# Altium schematic sheet 1_P1.schdoc
size 604 x 431 mm; Symbol: Sheet-Symbol_A4; Device: Sheet-Symbol_A4; Company: EasyEDA.com; Drawed: EasyEDA Pro; Reviewed: EasyEDA Pro; Version: V0.1; Page Size: A4; @Project Name: URC merc keyboard; @Page Count: 1; @Update Date: 2023-11-06; @Create Date: 2023-06-26; @Schematic Name: Schematic2; Part Number: JLCPCB-002; @Page No: 1; @Page Name: P1
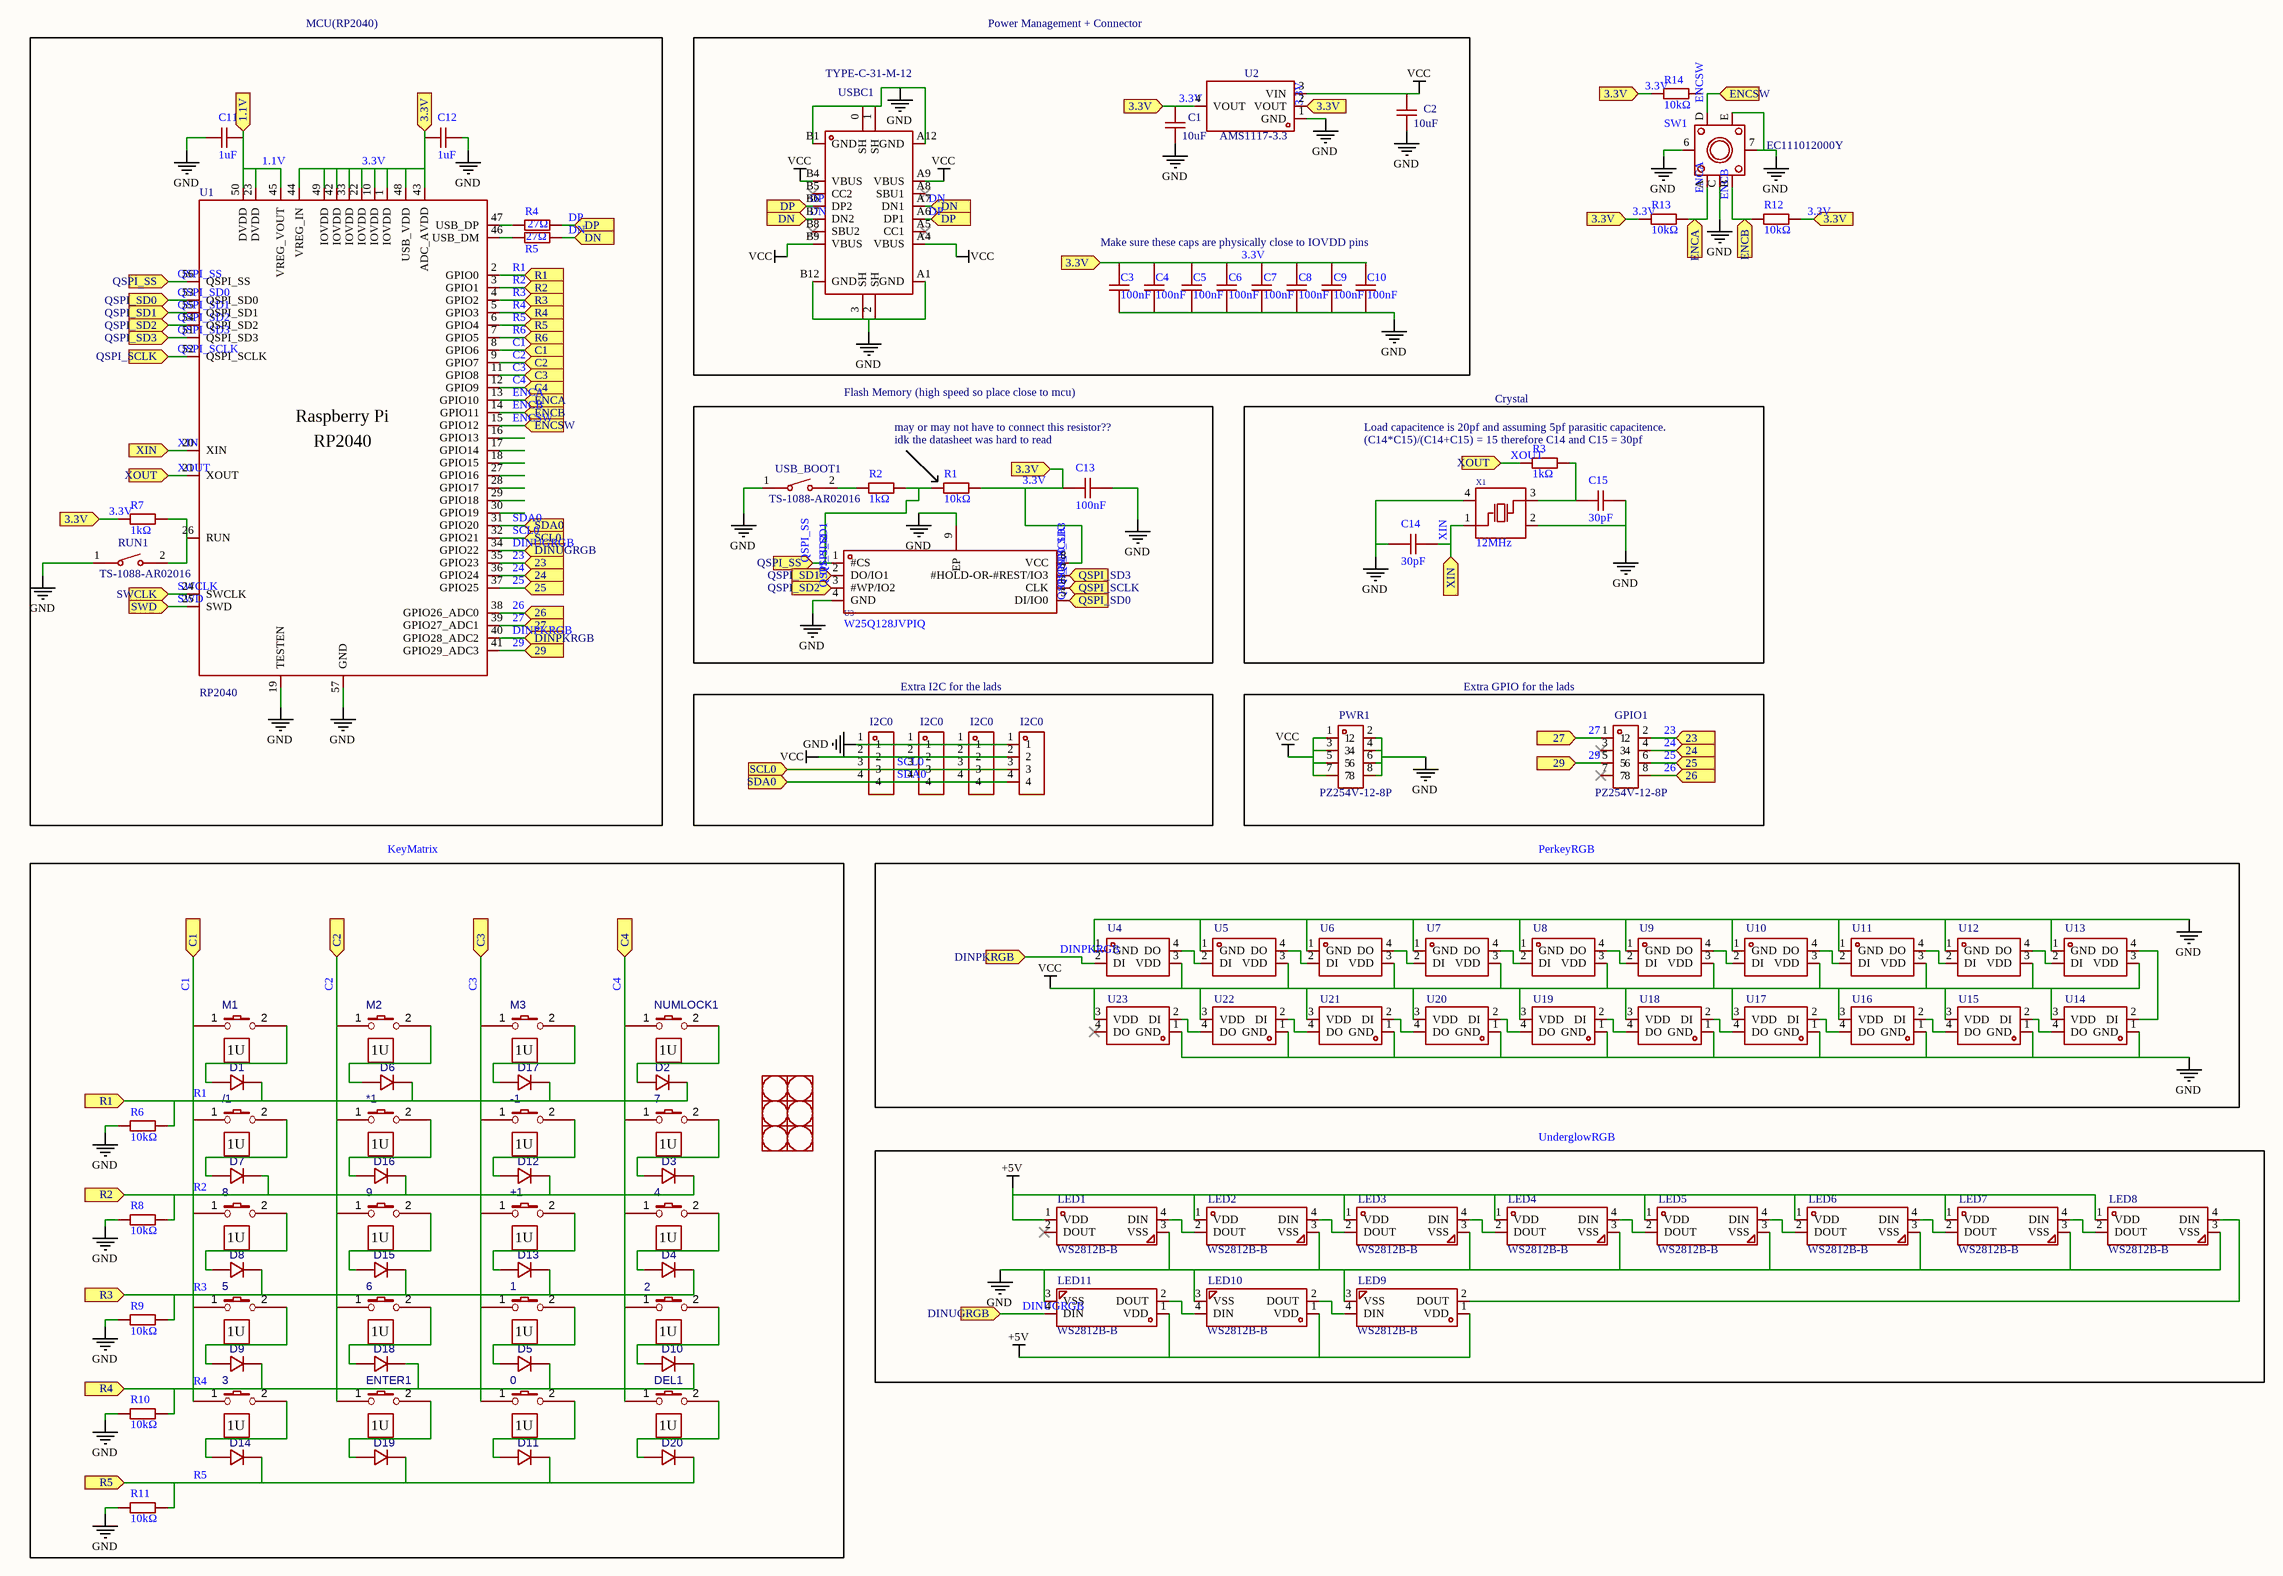
[diagram p0: 1_P1.schdoc]

## Parts
(Parts that share a designator on the sheet are numbered #1, #2 ... from top to bottom, then left to right.)
0  CHERRY-MX-SW-1U  [CHERRY-MX-PCB-1U]  (value not drawn)
1  CHERRY-MX-SW-1U  [CHERRY-MX-PCB-1U]  (value not drawn)
2  CHERRY-MX-SW-1U  [CHERRY-MX-PCB-1U]  (value not drawn)
3  CHERRY-MX-SW-1U  [CHERRY-MX-PCB-1U]  (value not drawn)
4  CHERRY-MX-SW-1U  [CHERRY-MX-PCB-1U]  (value not drawn)
5  CHERRY-MX-SW-1U  [CHERRY-MX-PCB-1U]  (value not drawn)
6  CHERRY-MX-SW-1U  [CHERRY-MX-PCB-1U]  (value not drawn)
7  CHERRY-MX-SW-1U  [CHERRY-MX-PCB-1U]  (value not drawn)
8  CHERRY-MX-SW-1U  [CHERRY-MX-PCB-1U]  (value not drawn)
9  CHERRY-MX-SW-1U  [CHERRY-MX-PCB-1U]  (value not drawn)
*1  CHERRY-MX-SW-1U  [CHERRY-MX-PCB-1U]  (value not drawn)
+1  CHERRY-MX-SW-1U  [CHERRY-MX-PCB-1U]  (value not drawn)
-1  CHERRY-MX-SW-1U  [CHERRY-MX-PCB-1U]  (value not drawn)
/1  CHERRY-MX-SW-1U  [CHERRY-MX-PCB-1U]  (value not drawn)
C1  10uF  [C0402]
C2  10uF  [C0402]
C3  100nF  [C0201]
C4  100nF  [C0201]
C5  100nF  [C0201]
C6  100nF  [C0201]
C7  100nF  [C0201]
C8  100nF  [C0201]
C9  100nF  [C0201]
C10  100nF  [C0201]
C11  1uF  [C0201]
C12  1uF  [C0201]
C13  100nF  [C0201]
C14  30pF  [C0201]
C15  30pF  [C0201]
D1  1N4148_C14538  [DO-35_BD2.0-L4.2-P8.20-D0.5-RD]  (value not drawn)
D2  1N4148_C14538  [DO-35_BD2.0-L4.2-P8.20-D0.5-RD]  (value not drawn)
D3  1N4148_C14538  [DO-35_BD2.0-L4.2-P8.20-D0.5-RD]  (value not drawn)
D4  1N4148_C14538  [DO-35_BD2.0-L4.2-P8.20-D0.5-RD]  (value not drawn)
D5  1N4148_C14538  [DO-35_BD2.0-L4.2-P8.20-D0.5-RD]  (value not drawn)
D6  1N4148_C14538  [DO-35_BD2.0-L4.2-P8.20-D0.5-RD]  (value not drawn)
D7  1N4148_C14538  [DO-35_BD2.0-L4.2-P8.20-D0.5-RD]  (value not drawn)
D8  1N4148_C14538  [DO-35_BD2.0-L4.2-P8.20-D0.5-RD]  (value not drawn)
D9  1N4148_C14538  [DO-35_BD2.0-L4.2-P8.20-D0.5-RD]  (value not drawn)
D10  1N4148_C14538  [DO-35_BD2.0-L4.2-P8.20-D0.5-RD]  (value not drawn)
D11  1N4148_C14538  [DO-35_BD2.0-L4.2-P8.20-D0.5-RD]  (value not drawn)
D12  1N4148_C14538  [DO-35_BD2.0-L4.2-P8.20-D0.5-RD]  (value not drawn)
D13  1N4148_C14538  [DO-35_BD2.0-L4.2-P8.20-D0.5-RD]  (value not drawn)
D14  1N4148_C14538  [DO-35_BD2.0-L4.2-P8.20-D0.5-RD]  (value not drawn)
D15  1N4148_C14538  [DO-35_BD2.0-L4.2-P8.20-D0.5-RD]  (value not drawn)
D16  1N4148_C14538  [DO-35_BD2.0-L4.2-P8.20-D0.5-RD]  (value not drawn)
D17  1N4148_C14538  [DO-35_BD2.0-L4.2-P8.20-D0.5-RD]  (value not drawn)
D18  1N4148_C14538  [DO-35_BD2.0-L4.2-P8.20-D0.5-RD]  (value not drawn)
D19  1N4148_C14538  [DO-35_BD2.0-L4.2-P8.20-D0.5-RD]  (value not drawn)
D20  1N4148_C14538  [DO-35_BD2.0-L4.2-P8.20-D0.5-RD]  (value not drawn)
DEL1  CHERRY-MX-SW-1U  [CHERRY-MX-PCB-1U]  (value not drawn)
ENTER1  CHERRY-MX-SW-1U  [CHERRY-MX-PCB-1U]  (value not drawn)
GPIO1  PZ254V-12-8P  [HDR-TH_8P-P2.54-V-M-R2-C4-S2.54]
I2C0#1  PZ200V-11-04P  [HDR-TH_4P-P2.00-V-M]  (value not drawn)
I2C0#2  PZ200V-11-04P  [HDR-TH_4P-P2.00-V-M]  (value not drawn)
I2C0#3  PZ200V-11-04P  [HDR-TH_4P-P2.00-V-M]  (value not drawn)
I2C0#4  PZ200V-11-04P  [HDR-TH_4P-P2.00-V-M]  (value not drawn)
LED1  WS2812B-B  [LED-SMD_4P-L5.0-W5.0-BL_TC5050RGB]
LED2  WS2812B-B  [LED-SMD_4P-L5.0-W5.0-BL_TC5050RGB]
LED3  WS2812B-B  [LED-SMD_4P-L5.0-W5.0-BL_TC5050RGB]
LED4  WS2812B-B  [LED-SMD_4P-L5.0-W5.0-BL_TC5050RGB]
LED5  WS2812B-B  [LED-SMD_4P-L5.0-W5.0-BL_TC5050RGB]
LED6  WS2812B-B  [LED-SMD_4P-L5.0-W5.0-BL_TC5050RGB]
LED7  WS2812B-B  [LED-SMD_4P-L5.0-W5.0-BL_TC5050RGB]
LED8  WS2812B-B  [LED-SMD_4P-L5.0-W5.0-BL_TC5050RGB]
LED9  WS2812B-B  [LED-SMD_4P-L5.0-W5.0-BL_TC5050RGB]
LED10  WS2812B-B  [LED-SMD_4P-L5.0-W5.0-BL_TC5050RGB]
LED11  WS2812B-B  [LED-SMD_4P-L5.0-W5.0-BL_TC5050RGB]
M1  CHERRY-MX-SW-1U  [CHERRY-MX-PCB-1U]  (value not drawn)
M2  CHERRY-MX-SW-1U  [CHERRY-MX-PCB-1U]  (value not drawn)
M3  CHERRY-MX-SW-1U  [CHERRY-MX-PCB-1U]  (value not drawn)
NUMLOCK1  CHERRY-MX-SW-1U  [CHERRY-MX-PCB-1U]  (value not drawn)
PWR1  PZ254V-12-8P  [HDR-TH_8P-P2.54-V-M-R2-C4-S2.54]
R1  10kΩ  [R0201]
R2  1kΩ  [R0201]
R3  1kΩ  [R0201]
R4  27Ω  [R0201]
R5  27Ω  [R0201]
R6  10kΩ  [R0201]
R7  1kΩ  [R0201]
R8  10kΩ  [R0201]
R9  10kΩ  [R0201]
R10  10kΩ  [R0201]
R11  10kΩ  [R0201]
R12  10kΩ  [R0201]
R13  10kΩ  [R0201]
R14  10kΩ  [R0201]
RUN1  TS-1088-AR02016  [SW-SMD_L3.9-W3.0-P4.45]
STB_1  Cherry MX Stabilizer  [CHERRY MX SWITCH STAB]  (value not drawn)
STB_2  Cherry MX Stabilizer  [CHERRY MX SWITCH STAB]  (value not drawn)
STB_3  Cherry MX Stabilizer  [CHERRY MX SWITCH STAB]  (value not drawn)
STB_4  Cherry MX Stabilizer  [CHERRY MX SWITCH STAB]  (value not drawn)
STB_5  Cherry MX Stabilizer  [CHERRY MX SWITCH STAB]  (value not drawn)
STB_6  Cherry MX Stabilizer  [CHERRY MX SWITCH STAB]  (value not drawn)
SW1  EC111012000Y  [SW-TH_EC111012000Y]
U1  RP2040  [LQFN-56_L7.0-W7.0-P0.4-EP]
U2  AMS1117-3.3  [SOT-223-3_L6.5-W3.4-P2.30-LS7.0-BR]
U3  W25Q128JVPIQ  [WSON-8_L6.0-W5.0-P1.27-BL-EP]
U4  XL-2121RGBC-WS2812B  [LED-SMD_4P-L2.1-W2.1-BL]  (value not drawn)
U5  XL-2121RGBC-WS2812B  [LED-SMD_4P-L2.1-W2.1-BL]  (value not drawn)
U6  XL-2121RGBC-WS2812B  [LED-SMD_4P-L2.1-W2.1-BL]  (value not drawn)
U7  XL-2121RGBC-WS2812B  [LED-SMD_4P-L2.1-W2.1-BL]  (value not drawn)
U8  XL-2121RGBC-WS2812B  [LED-SMD_4P-L2.1-W2.1-BL]  (value not drawn)
U9  XL-2121RGBC-WS2812B  [LED-SMD_4P-L2.1-W2.1-BL]  (value not drawn)
U10  XL-2121RGBC-WS2812B  [LED-SMD_4P-L2.1-W2.1-BL]  (value not drawn)
U11  XL-2121RGBC-WS2812B  [LED-SMD_4P-L2.1-W2.1-BL]  (value not drawn)
U12  XL-2121RGBC-WS2812B  [LED-SMD_4P-L2.1-W2.1-BL]  (value not drawn)
U13  XL-2121RGBC-WS2812B  [LED-SMD_4P-L2.1-W2.1-BL]  (value not drawn)
U14  XL-2121RGBC-WS2812B  [LED-SMD_4P-L2.1-W2.1-BL]  (value not drawn)
U15  XL-2121RGBC-WS2812B  [LED-SMD_4P-L2.1-W2.1-BL]  (value not drawn)
U16  XL-2121RGBC-WS2812B  [LED-SMD_4P-L2.1-W2.1-BL]  (value not drawn)
U17  XL-2121RGBC-WS2812B  [LED-SMD_4P-L2.1-W2.1-BL]  (value not drawn)
U18  XL-2121RGBC-WS2812B  [LED-SMD_4P-L2.1-W2.1-BL]  (value not drawn)
U19  XL-2121RGBC-WS2812B  [LED-SMD_4P-L2.1-W2.1-BL]  (value not drawn)
U20  XL-2121RGBC-WS2812B  [LED-SMD_4P-L2.1-W2.1-BL]  (value not drawn)
U21  XL-2121RGBC-WS2812B  [LED-SMD_4P-L2.1-W2.1-BL]  (value not drawn)
U22  XL-2121RGBC-WS2812B  [LED-SMD_4P-L2.1-W2.1-BL]  (value not drawn)
U23  XL-2121RGBC-WS2812B  [LED-SMD_4P-L2.1-W2.1-BL]  (value not drawn)
USB_BOOT1  TS-1088-AR02016  [SW-SMD_L3.9-W3.0-P4.45]
USBC1  TYPE-C-31-M-12  [USB-C_SMD-TYPE-C-31-M-12]
X1  12MHz  [CRYSTAL-SMD_4P-L3.2-W2.5-BL]

## Blocks framed on the sheet
MCU(RP2040): C11 C12 R4 R5 R7 RUN1 U1
Flash Memory (high speed so place close to mcu): C13 R1 R2 U3 USB_BOOT1
Crystal: C14 C15 R3 X1
Extra I2C for the lads: I2C0#1-I2C0#4
Extra GPIO for the lads: GPIO1 PWR1
KeyMatrix: 0-9 *1 +1 -1 /1 D1-D20 DEL1 ENTER1 M1-M3 NUMLOCK1 R6 R8-R11 STB_1-STB_6
PerkeyRGB: U4-U23
UnderglowRGB: LED1-LED11

## Ports
1.1V (in), 3.3V (in), 23 (in), 24 (in), 25 (in), 26 (in), 27 (in), 29 (in), C1 (in), C2 (in), C3 (in), C4 (in), DINPKRGB (in), DINUGRGB (in), DN (in), DP (in), ENCA (in), ENCB (in), ENCSW (in), QSPI_SCLK (in), QSPI_SD0 (in), QSPI_SD1 (in), QSPI_SD2 (in), QSPI_SD3 (in), QSPI_SS (in), R1 (in), R2 (in), R3 (in), R4 (in), R5 (in), R6 (in), SCL0 (in), SDA0 (in), SWCLK (in), SWD (in), XIN (in), XOUT (in)

## Nets
+5V: LED1.1(VDD) LED2.1(VDD) LED3.1(VDD) LED4.1(VDD) LED5.1(VDD) LED6.1(VDD) LED7.1(VDD) LED8.1(VDD) LED9.1(VDD) LED10.1(VDD) LED11.1(VDD)
GND: C1.1 C2.1 C3.1 C4.1 C5.1 C6.1 C7.1 C8.1 C9.1 C10.1 C11.1 C12.2 C13.1 C14.2 C15.1 I2C0#1.1 I2C0#2.1 I2C0#3.1 I2C0#4.1 LED1.3(VSS) LED2.3(VSS) LED3.3(VSS) LED4.3(VSS) LED5.3(VSS) LED6.3(VSS) LED7.3(VSS) LED8.3(VSS) LED9.3(VSS) LED10.3(VSS) LED11.3(VSS) PWR1.2 PWR1.4 PWR1.6 PWR1.8 R6.1 R8.1 R9.1 R10.1 R11.1 RUN1.1 SW1.6 SW1.7 SW1.C SW1.E U1.19(TESTEN) U1.57(GND) U2.1(GND) U3.4(GND) U3.9(EP) U4.1(GND) U5.1(GND) U6.1(GND) U7.1(GND) U8.1(GND) U9.1(GND) U10.1(GND) U11.1(GND) U12.1(GND) U13.1(GND) U14.1(GND) U15.1(GND) U16.1(GND) U17.1(GND) U18.1(GND) U19.1(GND) U20.1(GND) U21.1(GND) U22.1(GND) U23.1(GND) USB_BOOT1.1 USBC1.0(SH) USBC1.1(SH) USBC1.2(SH) USBC1.3(SH) USBC1.A1(GND) USBC1.A12(GND) USBC1.B1(GND) USBC1.B12(GND) X1.2(GND) X1.4(GND)
VCC: C2.2 I2C0#1.2 I2C0#2.2 I2C0#3.2 I2C0#4.2 PWR1.1 PWR1.3 PWR1.5 PWR1.7 U2.3(VIN) U4.3(VDD) U5.3(VDD) U6.3(VDD) U7.3(VDD) U8.3(VDD) U9.3(VDD) U10.3(VDD) U11.3(VDD) U12.3(VDD) U13.3(VDD) U14.3(VDD) U15.3(VDD) U16.3(VDD) U17.3(VDD) U18.3(VDD) U19.3(VDD) U20.3(VDD) U21.3(VDD) U22.3(VDD) U23.3(VDD) USBC1.A4(VBUS) USBC1.A9(VBUS) USBC1.B4(VBUS) USBC1.B9(VBUS)
1.1V: C11.2 U1.23(DVDD) U1.45(VREG_VOUT) U1.50(DVDD) ; port 1.1V
3.3V: C1.2 C3.2 C4.2 C5.2 C6.2 C7.2 C8.2 C9.2 C10.2 C12.1 C13.2 R1.2 R7.1 R12.2 R13.1 R14.1 U1.1(IOVDD) U1.10(IOVDD) U1.22(IOVDD) U1.33(IOVDD) U1.42(IOVDD) U1.43(ADC_AVDD) U1.44(VREG_IN) U1.48(USB_VDD) U1.49(IOVDD) U2.2(VOUT) U2.4(VOUT) U3.8(VCC) ; port 3.3V
23: GPIO1.2 U1.35(GPIO23) ; port 23
24: GPIO1.4 U1.36(GPIO24) ; port 24
25: GPIO1.6 U1.37(GPIO25) ; port 25
26: GPIO1.8 U1.38(GPIO26_ADC0) ; port 26
27: GPIO1.1 U1.39(GPIO27_ADC1) ; port 27
29: GPIO1.5 U1.41(GPIO29_ADC3) ; port 29
C1: 3.1(col) 5.1(col) 8.1(col) /1.1(col) D1.1 D2.1 D3.1 D4.1 D5.1 D6.1 D7.1 D8.1 D9.1 D10.1 D12.1 D13.1 D15.1 D16.1 D17.1 D18.1 M1.1(col) R6.2 R8.2 R9.2 R10.2 U1.2(GPIO0) U1.3(GPIO1) U1.4(GPIO2) U1.5(GPIO3) U1.8(GPIO6) ; port R1, port R2, port R3, port R4, port C1  [also labelled R1, R2, R3, R4]
C2: 6.1(col) 9.1(col) *1.1(col) ENTER1.1(col) M2.1(col) U1.9(GPIO7) ; port C2
C3: 0.1(col) 1.1(col) +1.1(col) -1.1(col) M3.1(col) U1.11(GPIO8) ; port C3
C4: 2.1(col) 4.1(col) 7.1(col) DEL1.1(col) NUMLOCK1.1(col) U1.12(GPIO9) ; port C4
DINPKRGB: U1.40(GPIO28_ADC2) U4.2(DI) ; port DINPKRGB
DINUGRGB: LED11.4(DIN) U1.34(GPIO22) ; port DINUGRGB
DN: R5.2 USBC1.A7(DN1) USBC1.B7(DN2) ; port DN
DP: R4.2 USBC1.A6(DP1) USBC1.B6(DP2) ; port DP
ENCA: R13.2 SW1.A U1.13(GPIO10) ; port ENCA
ENCB: R12.1 SW1.B U1.14(GPIO11) ; port ENCB
ENCSW: SW1.D U1.15(GPIO12) ; port ENCSW
QSPI_SCLK: U1.52(QSPI_SCLK) U3.6(CLK) ; port QSPI_SCLK
QSPI_SD0: U1.53(QSPI_SD0) U3.5(DI/IO0) ; port QSPI_SD0
QSPI_SD1: U1.55(QSPI_SD1) U3.2(DO/IO1) ; port QSPI_SD1
QSPI_SD2: U1.54(QSPI_SD2) U3.3(#WP/IO2) ; port QSPI_SD2
QSPI_SD3: U1.51(QSPI_SD3) U3.7(#HOLD-OR-#REST/IO3) ; port QSPI_SD3
QSPI_SS: R1.1 R2.2 U1.56(QSPI_SS) U3.1(#CS) ; port QSPI_SS
R5: D11.1 D14.1 D19.1 D20.1 R11.2 U1.6(GPIO4) ; port R5
R6: U1.7(GPIO5) ; port R6
SCL0: I2C0#1.3 I2C0#2.3 I2C0#3.3 I2C0#4.3 U1.32(GPIO21) ; port SCL0
SDA0: I2C0#1.4 I2C0#2.4 I2C0#3.4 I2C0#4.4 U1.31(GPIO20) ; port SDA0
SWCLK: U1.24(SWCLK) ; port SWCLK
SWD: U1.25(SWD) ; port SWD
XIN: C14.1 U1.20(XIN) X1.1(OSC1) ; port XIN
XOUT: R3.1 U1.21(XOUT) ; port XOUT
Net0_2: 0.2(row) D11.2
Net1_2: 1.2(row) D5.2
Net2_2: 2.2(row) D10.2
Net3_2: 3.2(row) D14.2
Net4_2: 4.2(row) D4.2
Net5_2: 5.2(row) D9.2
Net6_2: 6.2(row) D18.2
Net7_2: 7.2(row) D3.2
Net8_2: 8.2(row) D8.2
Net9_2: 9.2(row) D15.2
Net*1_2: *1.2(row) D16.2
Net+1_2: +1.2(row) D13.2
Net-1_2: -1.2(row) D12.2
Net/1_2: /1.2(row) D7.2
NetC15_2: C15.2 R3.2 X1.3(OSC2)
NetD1_2: D1.2 M1.2(row)
NetD2_2: D2.2 NUMLOCK1.2(row)
NetD6_2: D6.2 M2.2(row)
NetD17_2: D17.2 M3.2(row)
NetD19_2: D19.2 ENTER1.2(row)
NetD20_2: D20.2 DEL1.2(row)
NetLED1_4: LED1.4(DIN) LED2.2(DOUT)
NetLED2_4: LED2.4(DIN) LED3.2(DOUT)
NetLED3_4: LED3.4(DIN) LED4.2(DOUT)
NetLED4_4: LED4.4(DIN) LED5.2(DOUT)
NetLED5_4: LED5.4(DIN) LED6.2(DOUT)
NetLED6_4: LED6.4(DIN) LED7.2(DOUT)
NetLED7_4: LED7.4(DIN) LED8.2(DOUT)
NetLED8_4: LED8.4(DIN) LED9.2(DOUT)
NetLED9_4: LED9.4(DIN) LED10.2(DOUT)
NetLED10_4: LED10.4(DIN) LED11.2(DOUT)
NetR2_1: R2.1 USB_BOOT1.2
NetR4_1: R4.1 U1.47(USB_DP)
NetR5_1: R5.1 U1.46(USB_DM)
NetR7_2: R7.2 RUN1.2 U1.26(RUN)
NetU4_4: U4.4(DO) U5.2(DI)
NetU5_4: U5.4(DO) U6.2(DI)
NetU6_4: U6.4(DO) U7.2(DI)
NetU7_4: U7.4(DO) U8.2(DI)
NetU8_4: U8.4(DO) U9.2(DI)
NetU9_4: U9.4(DO) U10.2(DI)
NetU10_4: U10.4(DO) U11.2(DI)
NetU11_4: U11.4(DO) U12.2(DI)
NetU12_4: U12.4(DO) U13.2(DI)
NetU13_4: U13.4(DO) U14.2(DI)
NetU14_4: U14.4(DO) U15.2(DI)
NetU15_4: U15.4(DO) U16.2(DI)
NetU16_4: U16.4(DO) U17.2(DI)
NetU17_4: U17.4(DO) U18.2(DI)
NetU18_4: U18.4(DO) U19.2(DI)
NetU19_4: U19.4(DO) U20.2(DI)
NetU20_4: U20.4(DO) U21.2(DI)
NetU21_4: U21.4(DO) U22.2(DI)
NetU22_4: U22.4(DO) U23.2(DI)

Not connected (* = marked no-connect by the designer): GPIO1 3* 7*; LED1 2(DOUT)*; R14 2; U1 16(GPIO13) 17(GPIO14) 18(GPIO15) 27(GPIO16) 28(GPIO17) 29(GPIO18) 30(GPIO19); U23 4(DO)*; USBC1 A5(CC1)* A8(SBU1)* B5(CC2)* B8(SBU2)*

## Notes on the sheet
- Power Management + Connector
- Make sure these caps are physically close to IOVDD pins
- may or may not have to connect this resistor??
  idk the datasheet was hard to read
- Load capacitence is 20pf and assuming 5pf parasitic capacitence.
  (C14*C15)/(C14+C15) = 15 therefore C14 and C15 = 30pf
- 1
- 2
- 3
- 4
- 5
- 6
- A
- B
- C
- D
- Schematic
- Schematic2
- Create Date
- Update Date
- 2023-11-06
- 2023-06-26
- Reviewed
- Drawed
- Page
- EasyEDA Pro
- P1
- Part Number
- URC merc keyboard
- JLCPCB-002
- VER
- SIZE
- PAGE
- OF
- V0.1
- A4
- EasyEDA.com
- (in symbol CHERRY-MX-SW-1U) 1U
- (in symbol RP2040_C2040) Raspberry Pi

## Library data of the parts
0-9 *1 +1 -1 /1 DEL1 ENTER1 M1-M3 NUMLOCK1 = CHERRY-MX-SW-1U: Manufacturer Part: MX-SWITCH?; Add into BOM: yes; Symbol: CHERRY-MX-SW-1U; Device: CHERRY-MX-SW-1U; Supplier: CHERRY; Convert to PCB: yes; Origin Footprint: CHERRY-MX-PCB-1U
C1 C2 = CL05A106MQ5NUNC: Manufacturer: SAMSUNG(三星); Add into BOM: yes; Tolerance: ±20%; Symbol: CL05A106MQ5NUNC; Device: CL05A106MQ5NUNC; Supplier: LCSC; Manufacturer Part: CL05A106MQ5NUNC; Value: 10uF; Supplier Part: C15525; LCSC Part Name: 10uF ±20% 6.3V; Supplier Footprint: 0402; Datasheet: https://atta.szlcsc.com/upload/public/pdf/source/20220823/2B02EE04F8F211D38A52DCB16EB6BEBA.pdf; Convert to PCB: yes
C3-C10 C13 = CL03A104KO3NNNC: Manufacturer: SAMSUNG(三星); Add into BOM: yes; Tolerance: ±10%; Symbol: CL03A104KO3NNNC; Device: CL03A104KO3NNNC; LCSC Part Name: 100nF ±10% 16V; Supplier Part: C307380; Manufacturer Part: CL03A104KO3NNNC; Supplier Footprint: 0201; JLCPCB Part Class: Extended Part; Datasheet: https://atta.szlcsc.com/upload/public/pdf/source/20181009/C307380_E0679AAF9658ADA26DBF30CED0CA6925.pdf; Supplier: LCSC; Convert to PCB: yes; Value: 100nF
C11 C12 = CL03A105MQ3CSNH: Manufacturer: SAMSUNG(三星); Add into BOM: yes; Tolerance: ±20%; Symbol: CL03A105MQ3CSNH; Device: CL03A105MQ3CSNH; LCSC Part Name: 1uF ±20% 6.3V; Supplier Part: C53067; Manufacturer Part: CL03A105MQ3CSNH; Supplier Footprint: 0201; JLCPCB Part Class: Extended Part; Datasheet: https://atta.szlcsc.com/upload/public/pdf/source/20160103/1457707736151.pdf; Supplier: LCSC; Convert to PCB: yes; Value: 1uF
C14 C15 = C0603NP0300KGTS: Manufacturer: DARFON(达方); Add into BOM: yes; Tolerance: ±10%; Symbol: C0603NP0300KGTS; Device: C0603NP0300KGTS; LCSC Part Name: 30pF ±10% 50V; Supplier Part: C312064; Manufacturer Part: C0603NP0300KGTS; Supplier Footprint: 0201; JLCPCB Part Class: Extended Part; Datasheet: https://atta.szlcsc.com/upload/public/pdf/source/20181031/C312064_3333D0EB2E6573FA7DBF1C4706D84026.pdf; Supplier: LCSC; Convert to PCB: yes; Value: 30pF
D1-D20 = 1N4148_C14538: Manufacturer: ST(先科); Manufacturer Part: 1N4148; 3DModel: DO-35_D1.9-L3.9-P8.2; Add into BOM: yes; Symbol: 1N4148_C14538; Device: 1N4148_C14538; link: https://item.szlcsc.com/86229.html; Supplier: LCSC; Supplier Part: C14538; JLCPCB Part Class: Extended Part; Convert to PCB: yes; Origin Footprint: DO-35_BD2.0-L4.2-P8.20-D0.5-RD
GPIO1 PWR1 = PZ254V-12-8P: Manufacturer: XFCN(兴飞); Add into BOM: yes; Pitch: 2.54mm; Pin Structure: 2x4P; Circluar Pins/Square Pins: Square Pins; Symbol: PZ254V-12-8P; Device: PZ254V-12-8P; LCSC Part Name: 2.54mm 2x4P 直插 方针; Supplier Part: C492421; Manufacturer Part: PZ254V-12-8P; Supplier Footprint: 直插,P=2.54mm; Datasheet: https://atta.szlcsc.com/upload/public/pdf/source/20200309/C492421_DC8A206AF99CD7755BD4A5B0BC48200B.pdf; Supplier: LCSC; Convert to PCB: yes; Number of Rows: 双排; Number of Pins: 8; Row Spacing: 2.54mm; Mounting Type: Straight; Current Rating (Max): -; Voltage Rating (Max): -; Length of Mating Pin: 6mm; Insulation Height: 2.5mm; Length of End Connection Pin: 3mm; Contact Plating: -; Operating Temperature Range: -40℃~+105℃; Color: Black
I2C0#1-I2C0#4 = PZ200V-11-04P: Manufacturer: XFCN(兴飞); Add into BOM: yes; Pitch: 2mm; Pin Structure: 1x4P; Circluar Pins/Square Pins: Square Pins; Symbol: PZ200V-11-04P; Device: PZ200V-11-04P; LCSC Part Name: 2mm 1x4P 直插 方针; Supplier Part: C541858; Manufacturer Part: PZ200V-11-04P; Supplier Footprint: 直插,P=2mm; JLCPCB Part Class: Extended Part; Datasheet: https://atta.szlcsc.com/upload/public/pdf/source/20200518/C541858_7610F54454E936EFCDE06B655DF7C837.pdf; Supplier: LCSC; Convert to PCB: yes; Number of Rows: 单排; Number of Pins: 4; Row Spacing: -; Mounting Type: Straight; Current Rating (Max): -; Voltage Rating (Max): -; Length of Mating Pin: 3.9mm; Insulation Height: 2mm; Length of End Connection Pin: 2.8mm; Contact Plating: -; Operating Temperature Range: -40℃~+105℃; Welding Temperature (Max): -; Color: Black
LED1-LED11 = WS2812B-B: Manufacturer: worldsemi; Add into BOM: yes; Emitted Color: RGB; Symbol: WS2812B-B; Device: WS2812B-B; LCSC Part Name: RGB三色 （注意防潮，请查阅规格书中对应具体内容）; Supplier Part: C114586; Manufacturer Part: WS2812B-B; Supplier Footprint: SMD5050; Datasheet: https://atta.szlcsc.com/upload/public/pdf/source/20200615/C114586_26EB6813EC9F2A3F6C7FBB2AD75DE01F.pdf; Supplier: LCSC; Convert to PCB: yes
R1 R6 R8-R14 = RC0201FR-0710KL: Manufacturer: YAGEO(国巨); Add into BOM: yes; Tolerance: ±1%; Temperature Coefficient: ±200ppm/℃; Symbol: RC0201FR-0710KL; Device: RC0201FR-0710KL; LCSC Part Name: 10kΩ ±1% 50mW; Supplier Part: C106225; Manufacturer Part: RC0201FR-0710KL; Supplier Footprint: 0201; JLCPCB Part Class: Extended Part; Datasheet: https://atta.szlcsc.com/upload/public/pdf/source/20171221/C106225_15138309973201195185.pdf; Supplier: LCSC; Convert to PCB: yes; Type: Thick Film Resistors; Value: 10kΩ; Operating Temperature Range: -55℃~+125℃
R2 R3 R7 = RC0201FR-071KL: Manufacturer: YAGEO(国巨); Add into BOM: yes; Tolerance: ±1%; Temperature Coefficient: ±200ppm/℃; Symbol: RC0201FR-071KL; Device: RC0201FR-071KL; LCSC Part Name: 1kΩ ±1% 50mW; Supplier Part: C138165; Manufacturer Part: RC0201FR-071KL; Supplier Footprint: 0201; JLCPCB Part Class: Extended Part; Datasheet: https://atta.szlcsc.com/upload/public/pdf/source/20171107/C138165_15100517338981097059.pdf; Supplier: LCSC; Convert to PCB: yes; Type: Thick Film Resistors; Value: 1kΩ; Operating Temperature Range: -55℃~+125℃
R4 R5 = RC0201JR-0727RL: Manufacturer: YAGEO(国巨); Add into BOM: yes; Tolerance: ±5%; Temperature Coefficient: ±200ppm/℃; Symbol: RC0201JR-0727RL; Device: RC0201JR-0727RL; LCSC Part Name: 27Ω ±5% 50mW; Supplier Part: C273295; Manufacturer Part: RC0201JR-0727RL; Supplier Footprint: 0201; JLCPCB Part Class: Extended Part; Datasheet: https://atta.szlcsc.com/upload/public/pdf/source/20180821/C273295_C6D07EE5B6FA05AFFF11B09A8C10B88F.pdf; Supplier: LCSC; Convert to PCB: yes; Type: Thick Film Resistors; Value: 27Ω; Operating Temperature Range: -55℃~+125℃
RUN1 USB_BOOT1 = TS-1088-AR02016: Manufacturer: XUNPU(讯普); Add into BOM: yes; Contact Current: 50mA; Voltage Rating (DC): 12V; Insulation Resistance: 100MΩ; Circuit: SPST; Actuator Style: Round Button; Actuator/Cap Color: Black; Operating Force: 160gf@±50gf; Mechanical Life: 100000; Pin Style: SMDSplicing; Switch Length: 4mm; Switch Width: 3mm; Switch Height: 2mm; Strike Gundam: NO; Symbol: TS-1088-AR02016; Device: TS-1088-AR02016; LCSC Part Name: 3x4x2.0 160gf 贴片无柱轻触开关; Supplier Part: C720477; Manufacturer Part: TS-1088-AR02016; Supplier Footprint: SMD; Datasheet: https://atta.szlcsc.com/upload/public/pdf/source/20200810/C720475_60D09DD6C54279ADDB2DC25100F1CC11.pdf; Supplier: LCSC; Convert to PCB: yes; Mounting Style: Brick nogging; Operating Temperature: -30℃~+80℃
STB_1-STB_6 = Cherry MX Stabilizer: Manufacturer Part: G99-0379; Add into BOM: yes; Symbol: Cherry MX Stabilizer; Device: Cherry MX Stabilizer; Supplier Part: 540-G99-0379; Supplier: Mouser; link: http://www.mouser.com/ds/2/71/mx_cat-1079739.pdf; Convert to PCB: yes; Origin Footprint: CHERRY MX SWITCH STAB
SW1 = EC111012000Y: Manufacturer: ALPSALPINE(阿尔卑斯阿尔派); Add into BOM: yes; Symbol: EC111012000Y; Device: EC111012000Y; LCSC Part Name: 金属轴型编码器; Supplier Part: C2687280; Manufacturer Part: EC111012000Y; Supplier Footprint: 插件; JLCPCB Part Class: Extended Part; Datasheet: https://atta.szlcsc.com/upload/public/pdf/source/20210222/C2687280_45B192EED2F1068947CE5A047DD099ED.pdf; Supplier: LCSC; Convert to PCB: yes
U1 = RP2040_C2040: Manufacturer: Raspberry Pi(树莓派); Add into BOM: yes; CPU Core: ARM Cortex-M0; CPU Maximum Speed: 133MHz; RAM Size: 264KB; GPIO Ports Number: 30; ADC (Bit): 12bit; UART/USART: 2; Universal Serial Bus: 有; Peripheral/Function: DMA；PWM; Symbol: RP2040; Device: RP2040_C2040; LCSC Part Name: ARM Cortex-M0 133MHz; Supplier Part: C2040; Manufacturer Part: RP2040; Supplier Footprint: LQFN-56(7x7); Datasheet: https://atta.szlcsc.com/upload/public/pdf/source/20210621/C2040_96F425825606B7957D87DD32E2512CA9.pdf; Supplier: LCSC; Convert to PCB: yes; Operating Voltage Range: -; Program Storage Size: -; Program Memory Type: -; EEPROM: -; DAC (Bit): -; PWM (Bit): -; 8Bit Timer: -; 16Bit Timer: -; 32Bit Timer: -; CAN: -; I2C: 2; I2S: -; SPI: 2; Internal Comparator: -; communication protocol: -; Watchdog: -; Real-Time Clock: -; Infrared Data Association: -; Low-Voltage Detect: -; CCP Capture/Compare: -; Secure Digital Input and Output: -; Direct Memory Access: 有; Internal Oscillator: -; Operating Temperature Range: -
U2 = AMS1117-3.3_C6186: Manufacturer: AMS; Add into BOM: yes; Output Polarity: Positive; Number of Outputs: 1; Output Voltage: 3.3V~3.3V; Dropout Voltage: 1.3V@(800mA); Output Current: 1A; Power Supply Rejection Ratio (PSRR): 72dB@(120Hz); Symbol: AMS1117-3.3; Device: AMS1117-3.3_C6186; LCSC Part Name: 正 Vout=3.3V 1A 72dB@(120Hz); Supplier Part: C6186; Manufacturer Part: AMS1117-3.3; Supplier Footprint: SOT-223-3; JLCPCB Part Class: Basic Part; Datasheet: https://atta.szlcsc.com/upload/public/pdf/source/20180727/C6186_7A095716F0823C02F1997A905E26C086.pdf; Supplier: LCSC; Convert to PCB: yes; Maximum Input Voltage: -; Quiescent Current (Ground Current): -; Noise: -; Feature: -; Operating Temperature: -
U3 = W25Q128JVPIQ: Manufacturer: WINBOND(华邦); Symbol: W25Q128JVPIQTR; Add into BOM: yes; Device: W25Q128JVPIQ; Supplier: LCSC; Supplier Part: C190862; Manufacturer Part: W25Q128JVPIQ; JLCPCB Part Class: Extended Part; LCSC Part Name: W25Q128JVPIQ; Supplier Footprint: WSON-8-EP(5x6); Datasheet: https://atta.szlcsc.com/upload/public/pdf/source/20190705/C401662_06B6D416F67ED315879B366F63A3F7C9.pdf; Convert to PCB: yes
U4-U23 = XL-2121RGBC-WS2812B: Manufacturer: XINGLIGHT(成兴光); Add into BOM: yes; Emitted Color: RGB; Lens Color: 半透明雾状; Dominant Wavelength: 465nm~475nm；620nm~630nm；515nm~525nm; Forward Current: 20mA; Forward Voltage (VF): 3.5V~5.5V; Luminous Intensity: 300mcd；750mcd；200mcd; Mounting Sytle: 正贴; Symbol: XL-2121RGBC-WS2812B; Device: XL-2121RGBC-WS2812B; LCSC Part Name: 2121幻彩透明 2121幻彩透明; Supplier Part: C5349957; Manufacturer Part: XL-2121RGBC-WS2812B; Supplier Footprint: SMD-4P,2x2mm; Datasheet: https://atta.szlcsc.com/upload/public/pdf/source/20230111/D083B0C1CBE54F808BCFBBD78968642D.pdf; Supplier: LCSC; Convert to PCB: yes; Peak Wavelength: -; Power Dissipation: -; Viewing Angle: -; Operating Temperature: -30℃~+70℃
USBC1 = TYPE-C-31-M-12: Manufacturer: 韩国韩荣; Add into BOM: yes; Connector Type: Type-C; Gender: Female; Number of Contacts: 16; Number of Ports: 1; Current Rating - Power (Max): 5A; Symbol: TYPE-C-31-M-12; Device: TYPE-C-31-M-12; LCSC Part Name: Type-C 母座; Supplier Part: C165948; Manufacturer Part: TYPE-C-31-M-12; Supplier Footprint: SMD; Datasheet: https://atta.szlcsc.com/upload/public/pdf/source/20220525/466408E853115E789EDB0DDC29077C05.pdf; Supplier: LCSC; Convert to PCB: yes; Standard: -; Mounting Style: -; Contact Material: -; Contact Plating: -; Operating Temperature Range: -; Welding Temperature (Max): -
X1 = TAXM12M4RLBDDT2T: Manufacturer: TAE(雅晶鑫); Symbol: SMD-3225_4P12M20PF10PPM; Add into BOM: yes; Crystal Type: SMD 谐振器; Frequency Stability: ±20ppm; Equivalent Series Resistance (ESR): 50Ω; Device: TAXM12M4RLBDDT2T; Supplier: LCSC; Manufacturer Part: TAXM12M4RLBDDT2T; Value: 12MHz; Supplier Part: C133334; LCSC Part Name: 12MHz ±10ppm 20pF; Supplier Footprint: SMD3225-4P; Datasheet: https://atta.szlcsc.com/upload/public/pdf/source/20210910/A862C74DCD1FE9853DDB17F72A491972.pdf; Convert to PCB: yes; Operating Temperature: -